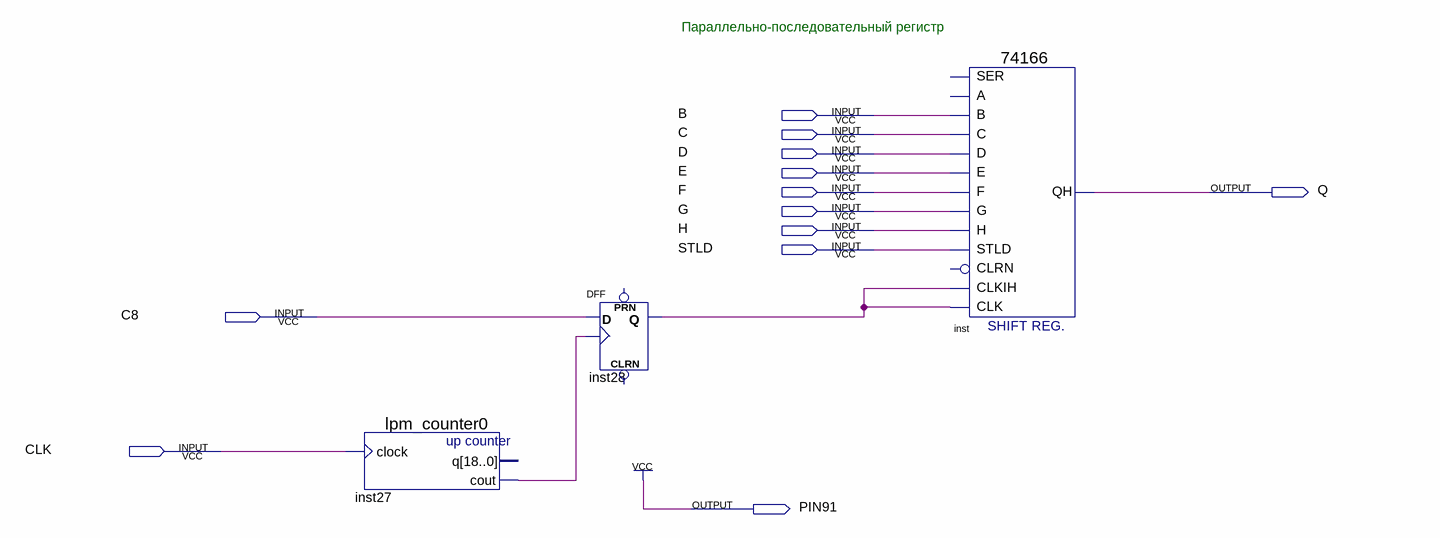
[diagram p0: schematic sheet]
// Quartus schematic Registers2.bdf as structural Verilog: 3 symbols, 12 pins
module Registers2 (
  input  B,
  input  C,
  input  D,
  input  E,
  input  F,
  input  G,
  input  H,
  input  STLD,
  input  C8,
  input  CLK,
  output Q,
  output PIN91
);

  wire inst27_cout, inst28_q;

  lpm_counter0 inst27 (.clock(CLK), .cout(inst27_cout));  // open: q
  DFF inst28 (.CLK(inst27_cout), .D(C8), .Q(inst28_q));  // open: CLRN, PRN
  \74166  inst (
    .C(C), .D(D), .E(E), .B(B), .STLD(STLD), .H(H), .G(G), .F(F), .CLK(inst28_q), .CLKIH(inst28_q), .QH(Q));  // open: SER, A, CLRN

  assign PIN91 = 1'b1;

  // Notes on the sheet:
  //   Параллельно-последовательный регистр
endmodule
